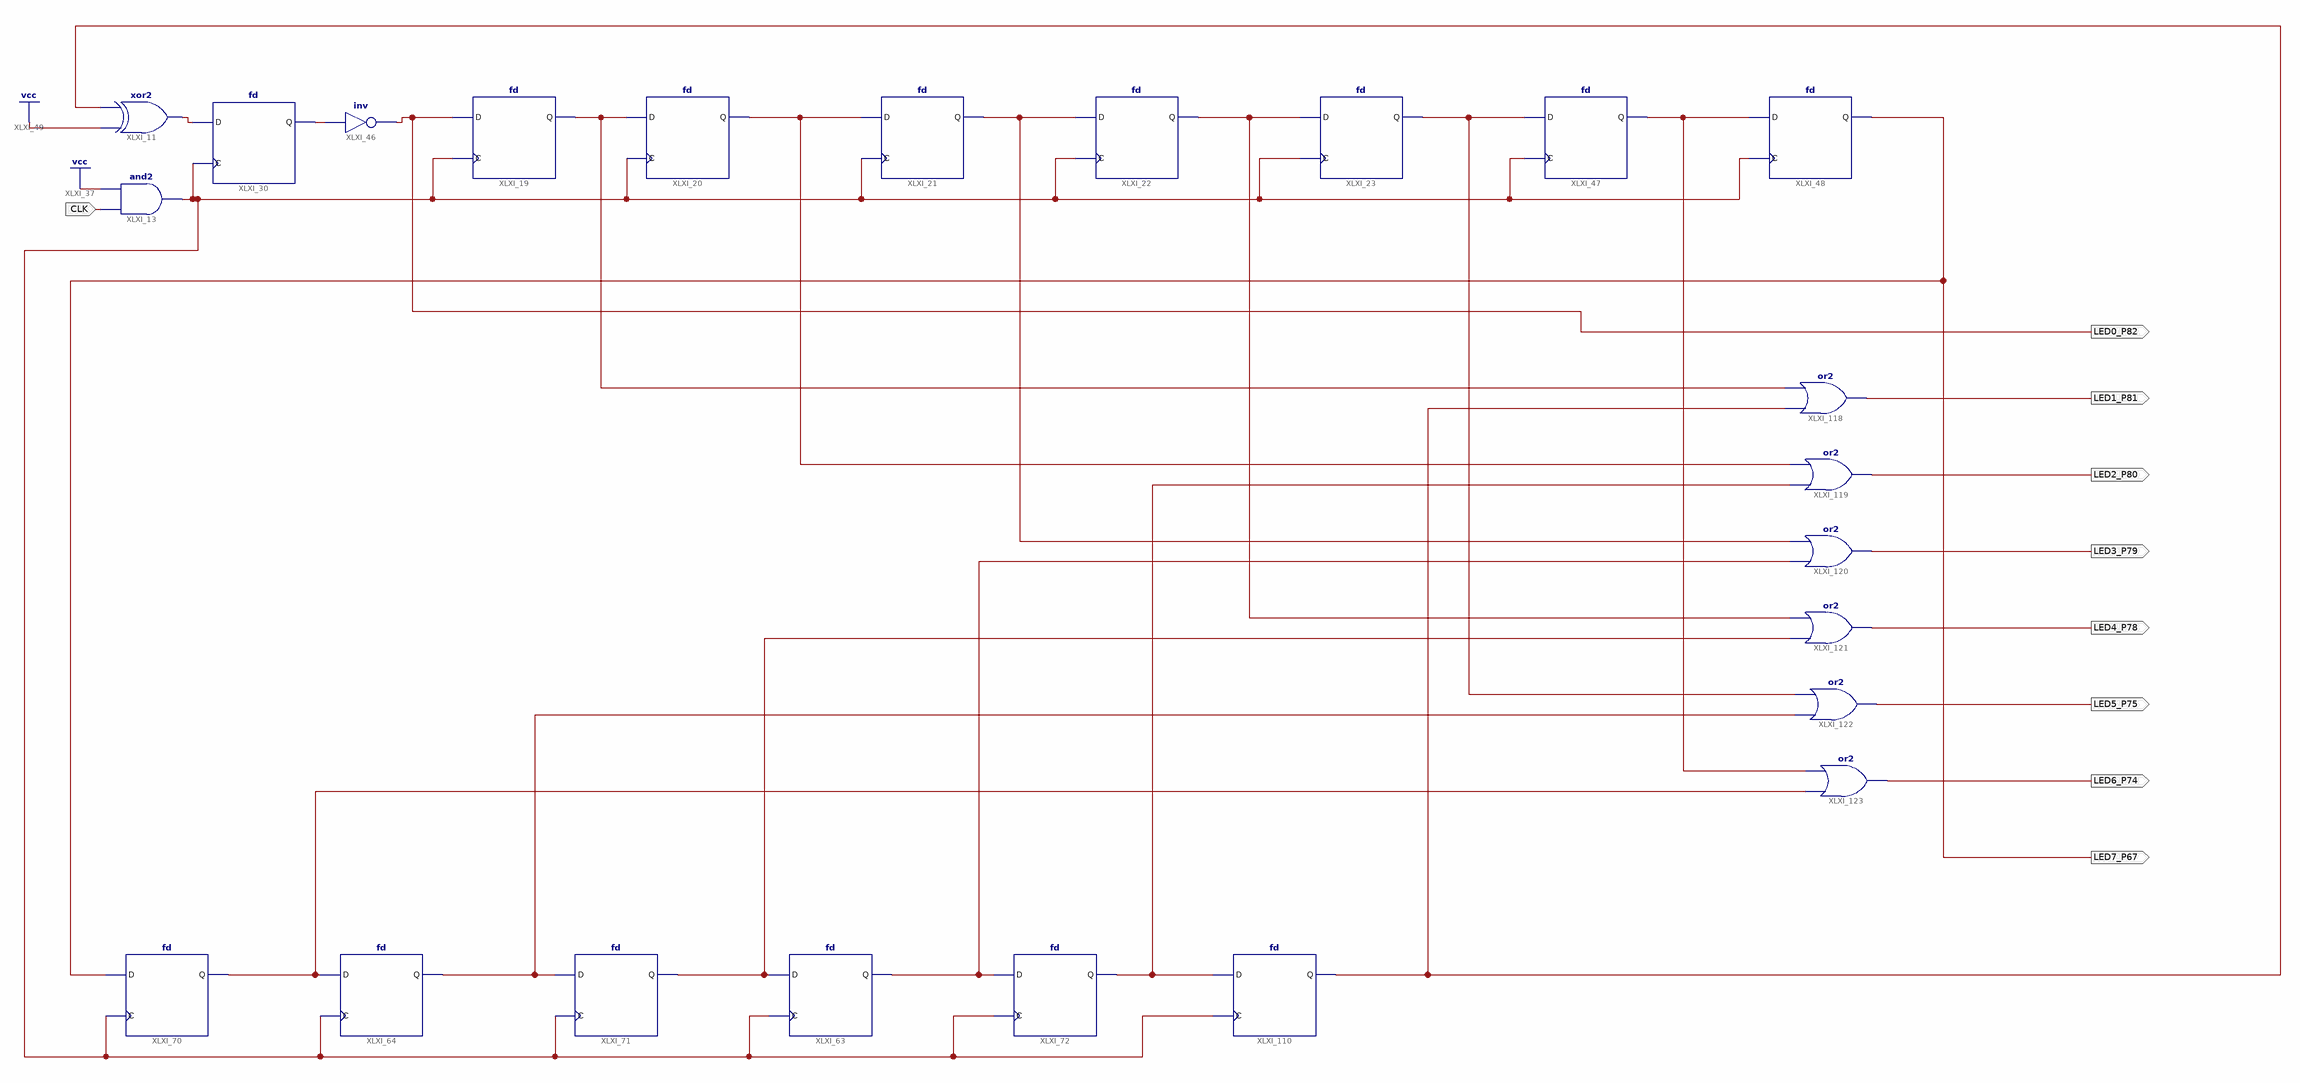
[diagram p0: schematic sheet 1]
// Xilinx ISE schematic seven_seg.sch (spartan6) as structural Verilog: 23 symbols, 9 ports
module seven_seg (
  input  CLK,
  output LED1_P81,
  output LED2_P80,
  output LED0_P82,
  output LED3_P79,
  output LED4_P78,
  output LED5_P75,
  output LED6_P74,
  output LED7_P67
);

  wire XLXN_29, XLXN_41, XLXN_87, XLXN_378, XLXN_379, XLXN_380, XLXN_381, XLXN_382;

  fd XLXI_22 (.C(XLXN_41), .D(LED3_P79), .Q(LED4_P78));
  fd XLXI_20 (.C(XLXN_41), .D(LED1_P81), .Q(LED2_P80));
  xor XLXI_11 (XLXN_29, 1'b1, LED7_P67);
  and XLXI_13 (XLXN_41, CLK, 1'b1);
  fd XLXI_30 (.C(XLXN_41), .D(XLXN_29), .Q(XLXN_87));
  not XLXI_46 (LED0_P82, XLXN_87);
  fd XLXI_19 (.C(XLXN_41), .D(LED0_P82), .Q(LED1_P81));
  fd XLXI_21 (.C(XLXN_41), .D(LED2_P80), .Q(LED3_P79));
  fd XLXI_23 (.C(XLXN_41), .D(LED4_P78), .Q(LED5_P75));
  fd XLXI_47 (.C(XLXN_41), .D(LED5_P75), .Q(LED6_P74));
  fd XLXI_48 (.C(XLXN_41), .D(LED6_P74), .Q(LED7_P67));
  fd XLXI_63 (.C(XLXN_41), .D(XLXN_380), .Q(XLXN_381));
  fd XLXI_64 (.C(XLXN_41), .D(XLXN_378), .Q(XLXN_379));
  fd XLXI_70 (.C(XLXN_41), .D(LED7_P67), .Q(XLXN_378));
  fd XLXI_71 (.C(XLXN_41), .D(XLXN_379), .Q(XLXN_380));
  fd XLXI_72 (.C(XLXN_41), .D(XLXN_381), .Q(XLXN_382));
  fd XLXI_110 (.C(XLXN_41), .D(XLXN_382), .Q(LED7_P67));
  or XLXI_118 (LED1_P81, LED7_P67, LED1_P81);
  or XLXI_119 (LED2_P80, XLXN_382, LED2_P80);
  or XLXI_120 (LED3_P79, XLXN_381, LED3_P79);
  or XLXI_121 (LED4_P78, XLXN_380, LED4_P78);
  or XLXI_122 (LED5_P75, XLXN_379, LED5_P75);
  or XLXI_123 (LED6_P74, XLXN_378, LED6_P74);
endmodule
